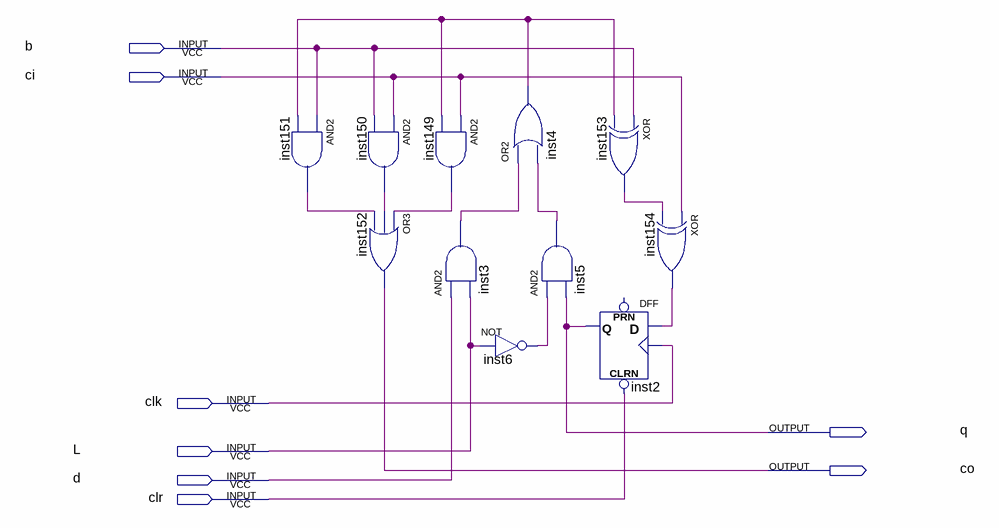
[diagram p0: schematic sheet]
// Quartus schematic jshdy.bdf as structural Verilog: 11 symbols, 8 pins
module jshdy (
  input  b,
  input  ci,
  input  clk,
  input  L,
  input  d,
  input  clr,
  output q,
  output co
);

  wire inst3_out, inst4_out, inst5_out, inst6_out, inst149_out, inst150_out, inst151_out, inst153_out,
       inst154_out;

  and inst151 (inst151_out, b, inst4_out);
  and inst150 (inst150_out, ci, b);
  or inst152 (co, inst149_out, inst150_out, inst151_out);
  and inst149 (inst149_out, ci, inst4_out);
  and inst3 (inst3_out, d, L);
  or inst4 (inst4_out, inst3_out, inst5_out);
  and inst5 (inst5_out, inst6_out, q);
  not inst6 (inst6_out, L);
  xor inst153 (inst153_out, b, inst4_out);
  DFF inst2 (.CLRN(clr), .CLK(clk), .D(inst154_out), .Q(q));  // open: PRN
  xor inst154 (inst154_out, ci, inst153_out);
endmodule
